# Altium schematic sheet HV Power Stage.SchDoc
size A4; Organization: TESLA Motors, INC; Address1: 3500 Deer Creek Road; Address2: Palo Alto, CA; Address4: U.S.A.; SheetNumber: 7; SheetTotal: 14
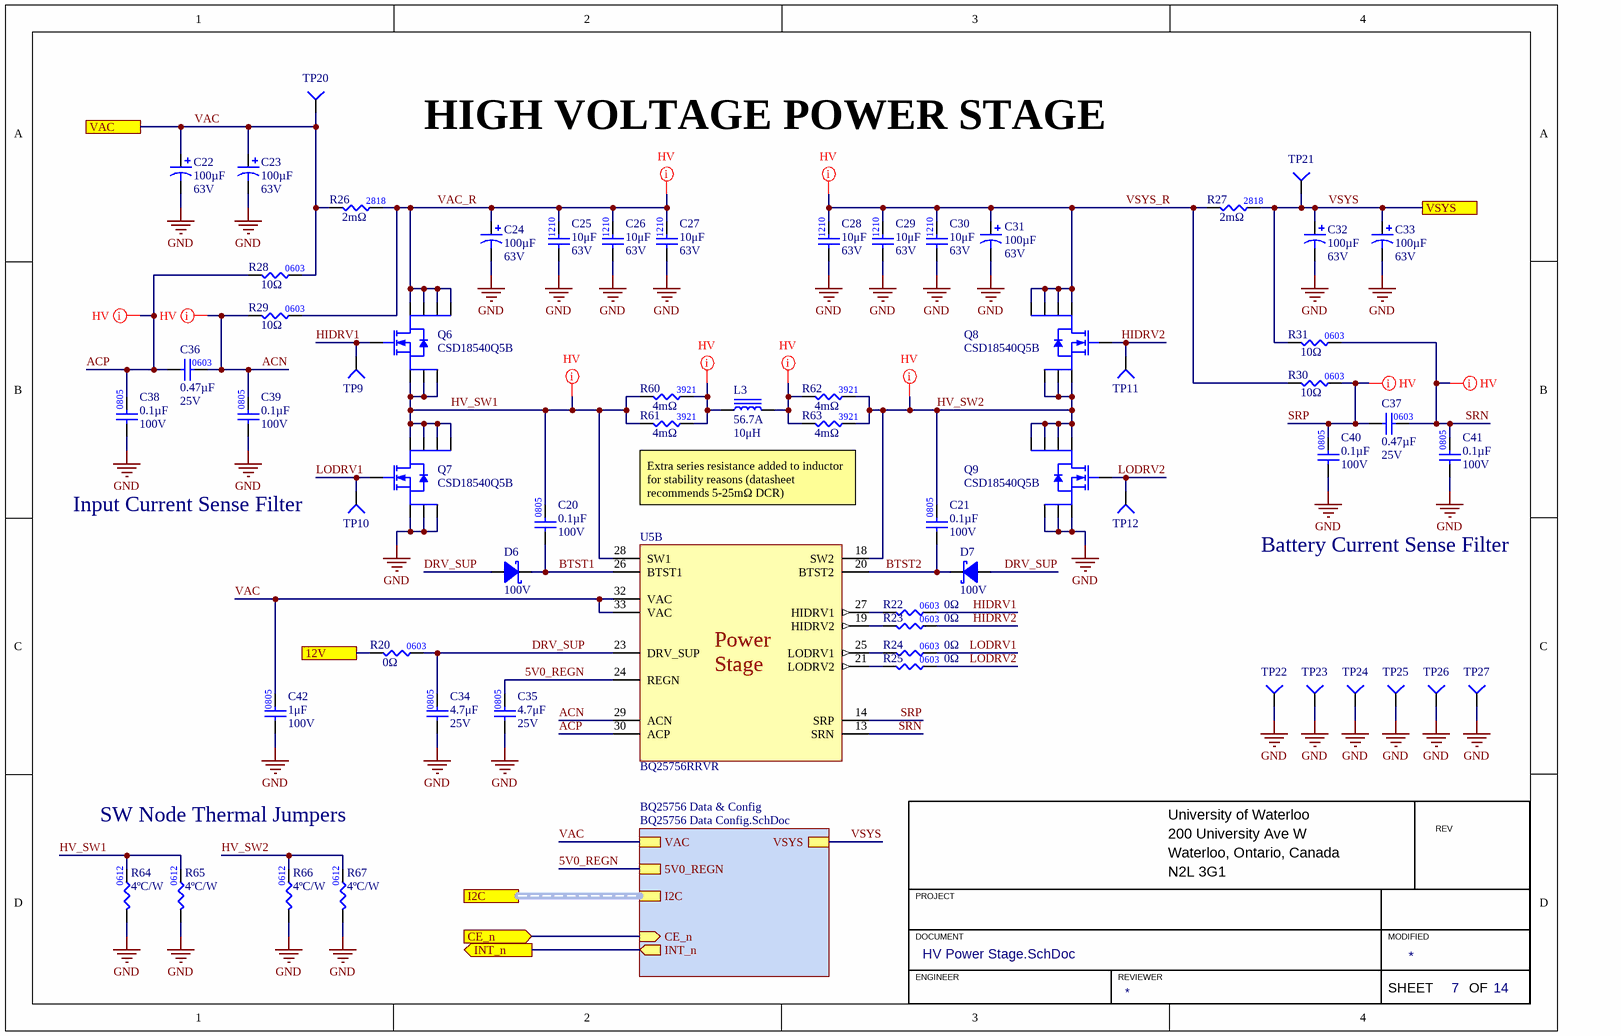
[diagram p0: HV Power Stage.SchDoc]

## Parts
C20  value 0.1µF  Voltage Rating: 100V  [CAP0805]  (hidden comment: CAP_0.1uF_100V_0805)
C21  value 0.1µF  Voltage Rating: 100V  [CAP0805]  (hidden comment: CAP_0.1uF_100V_0805)
C22  value 100µF  Voltage Rating: 63V  [RADIAL_KEMET_A781]  (hidden comment: CAP_100uF_63V_ALUMHYB)
C23  value 100µF  Voltage Rating: 63V  [RADIAL_KEMET_A781]  (hidden comment: CAP_100uF_63V_ALUMHYB)
C24  value 100µF  Voltage Rating: 63V  [RADIAL_KEMET_A781]  (hidden comment: CAP_100uF_63V_ALUMHYB)
C25  value 10μF  Voltage Rating: 63V  [CAP1210]  (hidden comment: CAP_10uF_63V_1210)
C26  value 10μF  Voltage Rating: 63V  [CAP1210]  (hidden comment: CAP_10uF_63V_1210)
C27  value 10μF  Voltage Rating: 63V  [CAP1210]  (hidden comment: CAP_10uF_63V_1210)
C28  value 10μF  Voltage Rating: 63V  [CAP1210]  (hidden comment: CAP_10uF_63V_1210)
C29  value 10μF  Voltage Rating: 63V  [CAP1210]  (hidden comment: CAP_10uF_63V_1210)
C30  value 10μF  Voltage Rating: 63V  [CAP1210]  (hidden comment: CAP_10uF_63V_1210)
C31  value 100µF  Voltage Rating: 63V  [RADIAL_KEMET_A781]  (hidden comment: CAP_100uF_63V_ALUMHYB)
C32  value 100µF  Voltage Rating: 63V  [RADIAL_KEMET_A781]  (hidden comment: CAP_100uF_63V_ALUMHYB)
C33  value 100µF  Voltage Rating: 63V  [RADIAL_KEMET_A781]  (hidden comment: CAP_100uF_63V_ALUMHYB)
C34  value 4.7μF  Voltage Rating: 25V  [CAP0805]  (hidden comment: CAP_4.7uF_25V_0805)
C35  value 4.7μF  Voltage Rating: 25V  [CAP0805]  (hidden comment: CAP_4.7uF_25V_0805)
C36  value 0.47µF  Voltage Rating: 25V  [CAP0603]  (hidden comment: CAP_0.47uF_25V_0603)
C37  value 0.47µF  Voltage Rating: 25V  [CAP0603]  (hidden comment: CAP_0.47uF_25V_0603)
C38  value 0.1µF  Voltage Rating: 100V  [CAP0805]  (hidden comment: CAP_0.1uF_100V_0805)
C39  value 0.1µF  Voltage Rating: 100V  [CAP0805]  (hidden comment: CAP_0.1uF_100V_0805)
C40  value 0.1µF  Voltage Rating: 100V  [CAP0805]  (hidden comment: CAP_0.1uF_100V_0805)
C41  value 0.1µF  Voltage Rating: 100V  [CAP0805]  (hidden comment: CAP_0.1uF_100V_0805)
C42  value 1μF  Voltage Rating: 100V  [CAP0805]  (hidden comment: CAP_1uF_100V_0805)
D6  Vr (Max): 100V  [SOD-123_FLAT]  (hidden comment: DIO_SCHOTTKY_100V_2A)
D7  Vr (Max): 100V  [SOD-123_FLAT]  (hidden comment: DIO_SCHOTTKY_100V_2A)
L3  Current Rating: 56.7A  Inductance: 10μH  [IND_WURTH_HCFT_TH]  (hidden comment: IND_10uH_56.7A)
Q6  Manufacturer Part Number 1: CSD18540Q5B  [DFN5060]  (hidden comment: NMOS_60V_100A_TI)
Q7  Manufacturer Part Number 1: CSD18540Q5B  [DFN5060]  (hidden comment: NMOS_60V_100A_TI)
Q8  Manufacturer Part Number 1: CSD18540Q5B  [DFN5060]  (hidden comment: NMOS_60V_100A_TI)
Q9  Manufacturer Part Number 1: CSD18540Q5B  [DFN5060]  (hidden comment: NMOS_60V_100A_TI)
R20  value 0Ω  [RES0603]  (hidden comment: RES_0Ω_0603)
R22  value 0Ω  [RES0603]  (hidden comment: RES_0Ω_0603)
R23  value 0Ω  [RES0603]  (hidden comment: RES_0Ω_0603)
R24  value 0Ω  [RES0603]  (hidden comment: RES_0Ω_0603)
R25  value 0Ω  [RES0603]  (hidden comment: RES_0Ω_0603)
R26  value 2mΩ  [RES2812_VISHAY]  (hidden comment: RES_2mΩ_2818_1%)
R27  value 2mΩ  [RES2812_VISHAY]  (hidden comment: RES_2mΩ_2818_1%)
R28  value 10Ω  [RES0603]  (hidden comment: RES_10Ω_0603_1%)
R29  value 10Ω  [RES0603]  (hidden comment: RES_10Ω_0603_1%)
R30  value 10Ω  [RES0603]  (hidden comment: RES_10Ω_0603_1%)
R31  value 10Ω  [RES0603]  (hidden comment: RES_10Ω_0603_1%)
R60  value 4mΩ  [RES3921]  (hidden comment: RES_4mΩ_3921_1%)
R61  value 4mΩ  [RES3921]  (hidden comment: RES_4mΩ_3921_1%)
R62  value 4mΩ  [RES3921]  (hidden comment: RES_4mΩ_3921_1%)
R63  value 4mΩ  [RES3921]  (hidden comment: RES_4mΩ_3921_1%)
R64  value 4ºC/W  [RES0612]  (hidden comment: THERM_JMP_4C_0612)
R65  value 4ºC/W  [RES0612]  (hidden comment: THERM_JMP_4C_0612)
R66  value 4ºC/W  [RES0612]  (hidden comment: THERM_JMP_4C_0612)
R67  value 4ºC/W  [RES0612]  (hidden comment: THERM_JMP_4C_0612)
TP9  TESTPOINT_1MM_CIRCLE  [TESTPOINT_CIRCLE_1MM]  (value not drawn)  (no BOM)
TP10  TESTPOINT_1MM_CIRCLE  [TESTPOINT_CIRCLE_1MM]  (value not drawn)  (no BOM)
TP11  TESTPOINT_1MM_CIRCLE  [TESTPOINT_CIRCLE_1MM]  (value not drawn)  (no BOM)
TP12  TESTPOINT_1MM_CIRCLE  [TESTPOINT_CIRCLE_1MM]  (value not drawn)  (no BOM)
TP20  TESTPOINT_KEYSTONE_LOOP  [KEYSTONE_5019]  (value not drawn)
TP21  TESTPOINT_KEYSTONE_LOOP  [KEYSTONE_5019]  (value not drawn)
TP22  TESTPOINT_KEYSTONE_LOOP  [KEYSTONE_5019]  (value not drawn)
TP23  TESTPOINT_KEYSTONE_LOOP  [KEYSTONE_5019]  (value not drawn)
TP24  TESTPOINT_KEYSTONE_LOOP  [KEYSTONE_5019]  (value not drawn)
TP25  TESTPOINT_KEYSTONE_LOOP  [KEYSTONE_5019]  (value not drawn)
TP26  TESTPOINT_KEYSTONE_LOOP  [KEYSTONE_5019]  (value not drawn)
TP27  TESTPOINT_KEYSTONE_LOOP  [KEYSTONE_5019]  (value not drawn)
U5  BQ25756RRVR  [TI_36-VQFN]  (part B of 3)

## Sub-sheets
BQ25756 Data & Config = BQ25756 Data Config.SchDoc: VAC, VSYS, I2C (harness I2C), 5V0_REGN, INT_n (out), CE_n (in)

## Ports
12V, CE_n (in), I2C (harness I2C), INT_n (out), VAC, VSYS

## Nets
GND: C22.2 C23.2 C24.2 C25.1 C26.1 C27.1 C28.1 C29.1 C30.1 C31.2 C32.2 C33.2 C34.1 C35.1 C38.1 C39.1 C40.1 C41.1 C42.1 Q7.1(Source) Q7.2(Source) Q7.3(Source) Q9.1(Source) Q9.2(Source) Q9.3(Source) R64.1 R65.1 R66.1 R67.1 TP22.1(=value) TP23.1(=value) TP24.1(=value) TP25.1(=value) TP26.1(=value) TP27.1(=value)
5V0_REGN: C35.2 U5.24(REGN) ; sheet BQ25756 Data & Config/5V0_REGN
12V: R20.1 ; port 12V
ACN: C36.2 C39.2 R29.1 U5.29(ACN)
ACP: C36.1 C38.2 R28.1 U5.30(ACP)
BTST1: C20.1 D6.2(Cathode) U5.26(BTST1)
BTST2: C21.1 D7.2(Cathode) U5.20(BTST2)
CE_n: port CE_n, sheet BQ25756 Data & Config/CE_n
DRV_SUP: C34.2 D6.1(Anode) D7.1(Anode) R20.2 U5.23(DRV_SUP)
HIDRV1: Q6.4(Gate) R22.2 TP9.1(=value)
HIDRV2: Q8.4(Gate) R23.2 TP11.1(=value)
HV_SW1: C20.2 Q6.1(Source) Q6.2(Source) Q6.3(Source) Q7.5(Drain) Q7.6(Drain) Q7.7(Drain) Q7.8(Drain) R60.1 R61.1 R64.2 R65.2 U5.28(SW1)
HV_SW2: C21.2 Q8.1(Source) Q8.2(Source) Q8.3(Source) Q9.5(Drain) Q9.6(Drain) Q9.7(Drain) Q9.8(Drain) R62.2 R63.2 R66.2 R67.2 U5.18(SW2)
INT_n: port INT_n, sheet BQ25756 Data & Config/INT_n
LODRV1: Q7.4(Gate) R24.2 TP10.1(=value)
LODRV2: Q9.4(Gate) R25.2 TP12.1(=value)
SRN: C37.2 C41.2 R31.2 U5.13(SRN)
SRP: C37.1 C40.2 R30.2 U5.14(SRP)
VAC: C22.1 C23.1 C42.2 R26.1 R28.2 TP20.1(=value) U5.32(VAC) U5.33(VAC) ; port VAC, sheet BQ25756 Data & Config/VAC
VAC_R: C24.1 C25.2 C26.2 C27.2 Q6.5(Drain) Q6.6(Drain) Q6.7(Drain) Q6.8(Drain) R26.2 R29.2
VSYS: C32.1 C33.1 R27.2 R31.1 TP21.1(=value) ; port VSYS, sheet BQ25756 Data & Config/VSYS
VSYS_R: C28.2 C29.2 C30.2 C31.1 Q8.5(Drain) Q8.6(Drain) Q8.7(Drain) Q8.8(Drain) R27.1 R30.1
NetL3_1: L3.1 R60.2 R61.2
NetL3_2: L3.2 R62.1 R63.1
NetR22_1: R22.1 U5.27(HIDRV1)
NetR23_1: R23.1 U5.19(HIDRV2)
NetR24_1: R24.1 U5.25(LODRV1)
NetR25_1: R25.1 U5.21(LODRV2)

## Buses and harness runs
harness port I2C = sheet BQ25756 Data & Config/I2C

## Layout directives
net class HV: ACN, ACP, HV_SW1, HV_SW2, NetL3_1, NetL3_2, SRN, SRP, VAC_R, VSYS_R

## Notes on the sheet
- HIGH VOLTAGE POWER STAGE
- (near TP10) Input Current Sense Filter
- Extra series resistance added to inductor for stability reasons (datasheet recommends 5-25mΩ DCR)
- Battery Current Sense Filter
- SW Node Thermal Jumpers
- University of Waterloo
- 200 University Ave W
- REV
- PROJECT
- Waterloo, Ontario, Canada
- N2L 3G1
- DOCUMENT
- ENGINEER
- REVIEWER
- MODIFIED
- SHEET
- OF
- (in symbol BQ25756RRVR, part B) Power Stage
- (in symbol CAP_1uF_100V_0805) 0805
- (in symbol CAP_4.7uF_25V_0805) 0805
- (in symbol RES_2mΩ_2818_1%) 2818
- (in symbol RES_4mΩ_3921_1%) 3921
- (in symbol RES_10Ω_0603_1%) 0603

## Library data of the parts
C20 C21 C38-C41 = CAP_0.1uF_100V_0805: CAP CER 0.1UF 100V X7R 0805; Manufacturer 1: TDK Corporation; Manufacturer Part Number 1: C2012X7R2A104K125AA; Package: 0805; Supplier 1: Digi-Key; Supplier Part Number 1: 445-1418-1-ND
C22-C24 C31-C33 = CAP_100uF_63V_ALUMHYB: CAP ALUMHYB 100UF 20% 63V SMD; Manufacturer 1: KEMET; Manufacturer Part Number 1: A781MS107M1JLAS030; Package/Footprint: Radial; Mounting Type: SMD; Supplier 1: Digikey; Supplier Part Number 1: 399-A781MS107M1JLAS030CT-ND
C25-C30 = CAP_10uF_63V_1210: CAP CER 10UF 63V X7R 1210; Manufacturer 1: Samsung Electro-Mechanics; Manufacturer Part Number 1: CL32B106KMVNNWE; Mounting Type: SMD; Package: 1210; Dielectric: X7R; Supplier 1: Digikey; Supplier Part Number 1: 1276-7053-6-ND
C34 C35 = CAP_4.7uF_25V_0805: CAP CER 4.7UF 25V X7R 0805; Manufacturer 1: Taiyo Yuden; Manufacturer Part Number 1: TMK212AB7475KG-T; Supplier 1: Digi-Key; Supplier Part Number 1: 587-2990-1-ND; Dielectric: X7R
C36 C37 = CAP_0.47uF_25V_0603: CAP CER 0.47UF 25V X7R 0603; Manufacturer 1: KEMET; Manufacturer Part Number 1: C0603C474K3RAC7867; Package: 0603; Supplier 1: Digi-Key; Supplier Part Number 1: 399-11934-1-ND
C42 = CAP_1uF_100V_0805: CAP CER 1UF 100V X7R 0805; Manufacturer 1: KYOCERA AVX; Manufacturer Part Number 1: 08051C105K4Z2A; Supplier 1: Digi-Key; Supplier Part Number 1: 478-KAF21KR72A105KUCT-ND; Dielectric: X7R
D6 D7 = DIO_SCHOTTKY_100V_2A: DIODE SCHOTTKY 100V 2A SOD123F; Manufacturer 1: STMicroelectronics; Manufacturer Part Number 1: STPSH100ZF; Package/Footprint: SOD-123F; Supplier 1: Digi-Key; Supplier Part Number 1: 497-17152-2-ND; Mounting Type: SMD; Verified: No
L3 = IND_10uH_56.7A: FIXED IND 10UH 56.7A 1.2 MOHM TH; Manufacturer 1: Würth Elektronik; Manufacturer Part Number 1: 7443763540100; DC Resistance (DCR): 1.2mΩ; Saturation Current: 62A; Supplier 1: Digikey; Supplier Part Number 1: 732-13640-ND
Q6-Q9 = NMOS_60V_100A_TI: MOSFET N-CH 60V 100A 8VSON; Manufacturer 1: Texas Instruments; FET Type: N-Channel; Vgs (Max): 20V; Power Dissipation (Max): 3.1W; Supplier 1: Digi-Key; Supplier Part Number 1: 296-41076-1-ND; Vdss: 60V; Supplier Device Package: 8-PowerTDFN; Id: 100A
R20 R22-R25 = RES_0Ω_0603: RES 0 OHM JUMPER 1/10W 0603; Manufacturer 1: Yageo; Manufacturer Part Number 1: RC0603JR-070RL; Supplier Part Number 1: 311-0.0GRCT-ND; Supplier 1: Digi-Key; Mounting Type: SMD; Package: 0603
R26 R27 = RES_2mΩ_2818_1%: RES 0.002 OHM 1% 10W 2818; Manufacturer 1: Vishay Dale; Manufacturer Part Number 1: WSHP28182L000FEA; Supplier 1: Digi-Key; Supplier Part Number 1: 541-3273-1-ND
R28-R31 = RES_10Ω_0603_1%: RES 10 OHM 1% 1/10W 0603; Manufacturer 1: Vishay Dale; Manufacturer Part Number 1: CRCW060310R0FKEA; Supplier Part Number 1: 541-10.0HCT-ND; Supplier 1: Digi-Key
R60-R63 = RES_4mΩ_3921_1%: RES 0.004 OHM 1% 5W 3921; Manufacturer 1: Thin Film Technology Corp.; Manufacturer Part Number 1: D1CSA3921FR004F-T3; Supplier 1: DigiKey; Supplier Part Number 1: 4463-D1CSA3921FR004F-T3DKR-ND
R64-R67 = THERM_JMP_4C_0612: THERMAL JUMPER 0612 30 MIL LEAD-; Manufacturer 1: Vishay Dale Thin Film; Manufacturer Part Number 1: THJP0612AST1; Supplier Part Number 1: 764-THJP0612AST1CT-ND; Supplier 1: Digi-Key; Mounting Type: SMD; Package: 0612
TP9-TP12 = TESTPOINT_1MM_CIRCLE: TESTPOINT 1MM CIRCLE
TP20-TP27 = TESTPOINT_KEYSTONE_LOOP: PC TEST POINT MINIATURE; Manufacturer 1: Keystone Electronics; Manufacturer Part Number 1: 5019; Package/Footprint: SMD; Supplier 1: Digi-Key; Mounting Type: SMD; Supplier Part Number 1: 36-5019CT-ND
U5 = BQ25756RRVR: IC BATT CHARGER BUCK-BOOST CTRLR; Manufacturer 1: Texas Instruments; Package/Footprint: 36-VQFN; Supplier 1: Digikey; Supplier Part Number 1: 296-BQ25756RRVRCT-ND; Manufacturer Part Number 1: BQ25756RRVR